# Altium project BTL_main.PrjPcb
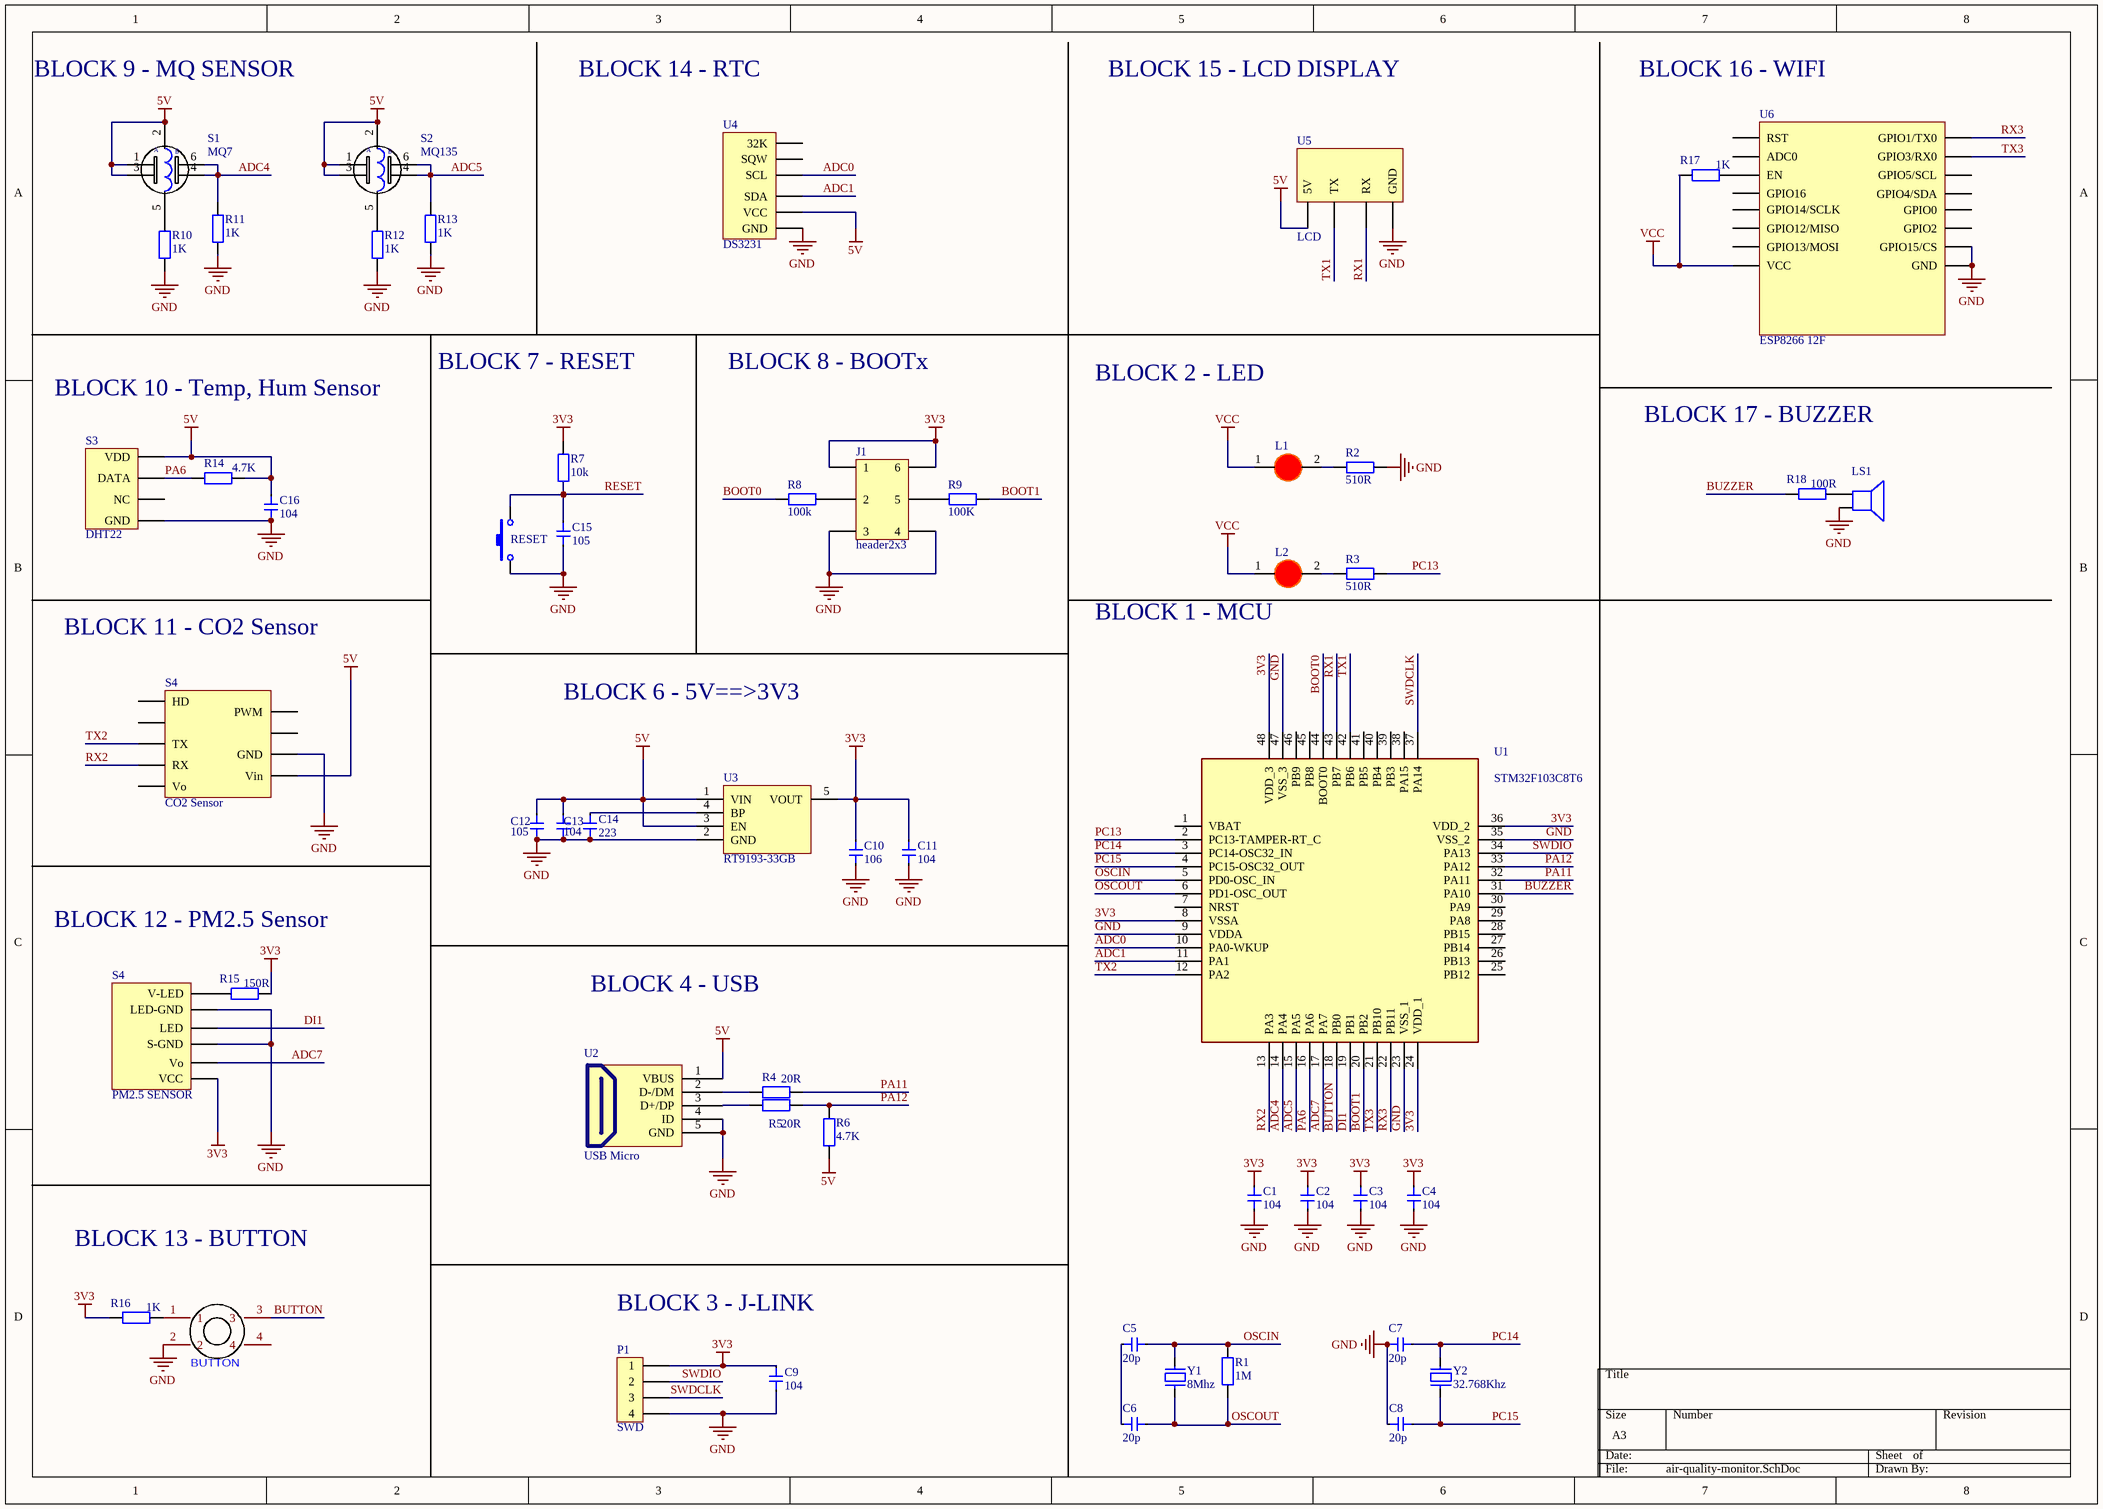
[diagram p0: air-quality-monitor.SchDoc]
1 sheet, 54 parts. Net scope: global (net labels, ports and power ports of the same name join across sheets).
Board file: air-quality-monitor.PcbDoc

## Sheet air-quality-monitor.SchDoc
size A3; SheetNumber: 1; SheetTotal: 1

### Parts
(Parts that share a designator on the sheet are numbered #1, #2 ... from top to bottom, then left to right.)
BUTTON  Nut Nhan 4 chan 12x12  [12X12 BUTTOM Blue]  (value not drawn)
C1  104  [Cap 0603]
C2  104  [Cap 0603]
C3  104  [Cap 0603]
C4  104  [Cap 0603]
C5  20p  [Cap 0603]
C6  20p  [Cap 0603]
C7  20p  [Cap 0603]
C8  20p  [Cap 0603]
C9  104  [Cap 0603]
C10  106  [Cap 0805]
C11  104  [Cap 0805]
C12  105  [Cap 0805]
C13  104  [Cap 0603]
C14  223  [Cap 0603]
C15  105  [Cap 0603]
C16  104  [Cap 0603]
J1  header2x3  [header2x3]
L1  LED 0805  [LED-0805-Red]  (value not drawn)
L2  LED 0805  [LED-0805-Red]  (value not drawn)
LS1  Coi Chip Speaker  [Coi Chip Speacker]  (value not drawn)
P1  SWD  [header4p_90]
R1  1M  [tro smd 0603]
R2  510R  [tro smd 0603]
R3  510R  [tro smd 0603]
R4  20R  [tro smd 0603]
R5  20R  [tro smd 0603]
R6  4.7K  [tro smd 0603]
R7  10k  [tro smd 0603]
R8  100k  [tro smd 0603]
R9  100K  [tro smd 0603]
R10  1K  [tro smd 0603]
R11  1K  [tro smd 0603]
R12  1K  [tro smd 0603]
R13  1K  [tro smd 0603]
R14  4.7K  [tro smd 0603]
R15  150R  [tro smd 0603]
R16  1K  [tro smd 0603]
R17  1K  [tro smd 0603]
R18  100R  [tro smd 0603]
RESET  Nut Nhan 2 Chan SMD 3x6x2.5  [Nut Nhan 2 Chan SMD 3x6x2.5]  (value not drawn)
S1  MQ7  [mq7]
S2  MQ135  [mq135]
S3  DHT22  [dht22]
S4#1  CO2 Sensor  [co2sensor]
S4#2  PM2.5 SENSOR  [pm25sensor]
U1  STM32F103C8T6  [LQFP-48_19.6_393_58X11_SMD]
U2  USB Micro  [USB Micro 5p SMD]
U3  RT9193-33GB  [SOT23-5]
U4  DS3231  [DS3231]
U5  LCD  [LCD]
U6  ESP8266 12F  [ESP826612F]
Y1  8Mhz  [Thach Anh 2 chan SMD]
Y2  32.768Khz  [Thach Anh 2 chan SMD]

### Nets
3V3: C1.1 C2.1 C3.1 C4.1 C9.1 C10.1 C11.1 J1.1 J1.6 P1.1 R7.1 R15.2 R16.1 S4#2.6(VCC) U1.8(VSSA) U1.24(VDD_1) U1.36(VDD_2) U1.48(VDD_3) U3.5(VOUT)
5V: C12.1 C13.1 C16.1 R6.1 R14.2 S1.1 S1.2 S1.3 S2.1 S2.2 S2.3 S3.1(VDD) S4#1.9(Vin) U2.1(VBUS) U3.1(VIN) U3.3(EN) U4.5(VCC) U5.1(5V)
GND: BUTTON.2 C1.2 C2.2 C3.2 C4.2 C7.1 C8.1 C9.2 C10.2 C11.2 C12.2 C13.2 C14.2 C15.2 C16.2 J1.3 J1.4 LS1.2 P1.4 R2.2 R10.1 R11.2 R12.1 R13.2 RESET.1 S3.4(GND) S4#1.8(GND) S4#2.1(LED-GND) S4#2.4(S-GND) U1.9(VDDA) U1.23(VSS_1) U1.35(VSS_2) U1.47(VSS_3) U2.4(ID) U2.5(GND) U3.2(GND) U4.6(GND) U5.4(GND) U6.15(GND) U6.16(GPIO15/CS)
VCC: L1.1(A) L2.1(A) R17.1 U6.8(VCC)
ADC0: U1.10(PA0-WKUP) U4.3(SCL)
ADC1: U1.11(PA1) U4.4(SDA)
ADC4: R11.1 S1.4 S1.6 U1.14(PA4)
ADC5: R13.1 S2.4 S2.6 U1.15(PA5)
ADC7: S4#2.5(Vo) U1.17(PA7)
BOOT0: R8.2 U1.44(BOOT0)
BOOT1: R9.1 U1.20(PB2)
BUTTON: BUTTON.3 U1.18(PB0)
BUZZER: R18.1 U1.31(PA10)
DI1: S4#2.3(LED) U1.19(PB1)
OSCIN: C5.2 R1.2 U1.5(PD0-OSC_IN) Y1.2
OSCOUT: C6.2 R1.1 U1.6(PD1-OSC_OUT) Y1.1
PA6: R14.1 S3.1(DATA) U1.16(PA6)
PA11: R4.1 U1.32(PA11)
PA12: R5.1 R6.2 U1.33(PA12)
PC13: R3.2 U1.2(PC13-TAMPER-RT_C)
PC14: C7.2 U1.3(PC14-OSC32_IN) Y2.2
PC15: C8.2 U1.4(PC15-OSC32_OUT) Y2.1
RESET: C15.1 R7.2 RESET.2
RX1: U1.43(PB7) U5.4(RX)
RX2: S4#1.4(RX) U1.13(PA3)
RX3: U1.22(PB11) U6.22(GPIO1/TX0)
SWDCLK: P1.3 U1.37(PA14)
SWDIO: P1.2 U1.34(PA13)
TX1: U1.42(PB6) U5.2(TX)
TX2: S4#1.3(TX) U1.12(PA2)
TX3: U1.21(PB10) U6.21(GPIO3/RX0)
NetBUTTON_1: BUTTON.1 R16.2
NetC5_1: C5.1 C6.1
NetC14_1: C14.1 U3.4(BP)
NetJ1_2: J1.2 R8.1
NetJ1_5: J1.5 R9.2
NetL1_2: L1.2(K) R2.1
NetL2_2: L2.2(K) R3.1
NetLS1_1: LS1.1 R18.2
NetR4_2: R4.2 U2.2(D-/DM)
NetR5_2: R5.2 U2.3(D+/DP)
NetR10_2: R10.2 S1.5
NetR12_2: R12.2 S2.5
NetR15_1: R15.1 S4#2.1(V-LED)
NetR17_2: R17.2 U6.3(EN)

Not connected (* = marked no-connect by the designer): BUTTON 4; S3 3(NC); S4#1 1(HD) 2 5(Vo) 6(PWM) 7; U1 1(VBAT) 7(NRST) 25(PB12) 26(PB13) 27(PB14) 28(PB15) 29(PA8) 30(PA9) 38(PA15) 39(PB3) 40(PB4) 41(PB5) 45(PB8) 46(PB9); U4 1(32K) 2(SQW); U6 1(RST) 2(ADC0) 4(GPIO16) 6(GPIO12/MISO) 7(GPIO13/MOSI) 17(GPIO2) 18(GPIO0) 19(GPIO4/SDA) 20(GPIO5/SCL)

### Notes on the sheet
- BLOCK 9 - MQ SENSOR
- BLOCK 14 - RTC
- BLOCK 15 - LCD DISPLAY
- BLOCK 16 - WIFI
- BLOCK 10 - Temp, Hum Sensor
- BLOCK 7 - RESET
- BLOCK 8 - BOOTx
- BLOCK 2 - LED
- BLOCK 17 - BUZZER
- BLOCK 11 - CO2 Sensor
- (near L2) BLOCK 1 - MCU
- BLOCK 6 - 5V==>3V3
- BLOCK 12 - PM2.5 Sensor
- BLOCK 4 - USB
- BLOCK 13 - BUTTON
- BLOCK 3 - J-LINK
- (in symbol MQ7) A; B
- (in symbol MQ135) A; B

### Library data of the parts
C1-C9 C13-C16 = Cap 0603: Capacitor SMD 0603
C10-C12 = Cap 0805: Capacitor SMD 0805
L1 L2 = LED 0805 Do: Dán; Don_Vi: Con; Ma_Hang: MH000897; Ten_Linh_Kien: LED 0805 Màu Đỏ (Red); Ghi_Chu: *; Kieu_Chan: *; Chung_Loai: Dán
LS1 = Coi Chip Speaker: Còi chip
P1 = header4p_90
R1 R4-R6 = Tro 0603 1% 1k: Dán; So_Chan: 2; Don_Vi: Con; Ten_Linh_Kien: Trở 0603 1% 1k; Ma_Hang: MH006334; Chung_Loai: Dán; Kieu_Chan: *
R2 R3 R7-R18 = Tro 0603 1% 10k: Dán; Don_Vi: Con; So_Chan: 2; Ten_Linh_Kien: Trở 0603 1% 10k; Ma_Hang: MH006333; Chung_Loai: Dán; Kieu_Chan: *
RESET = Nut Nhan 2 Chan SMD 3x6x2.5: Ma_Hang: MH001036; Ten: Nút Nhấn 2 Chân 3x6x2.5MM SMD
U1 = IC_STM32F103C8T6: ARM® Cortex®-M3 STM32F1 Microcontroller IC 32-Bit 72MHz 64KB (64K x 8) FLASH 48-LQFP (7x7); Manufacturer: STMicroelectronics; Alternate Part Number-1: NA; Manufacturer Part Number: STM32F103C8T6; Case/Package: LQFP48; Supplier-1: LCSC; Supplier Part Number-1: STM32F103C8T6
U2 = USB Micro 5p SMD: USB Type B; Ten: MicroUSB MK5P SMD; Ma_Hang: MH001020
U3 = REG_5.5V-3.3V-0.3A-1W-SOT-23-5: Linear Voltage Regulator IC 1 Output 300mA SOT-23-5; Manufacturer: Richtek USA Inc.; Alternate Part Number-1: NA; Manufacturer Part Number: RT9193-33GB; Supplier-1: LCSC; Supplier Part Number-1: C15651; Case/Package: SOT-23-5
Y1 Y2 = Thach Anh 2 chan SMD: Crystal For all Crystal 2pin.; Value: 4Mhz